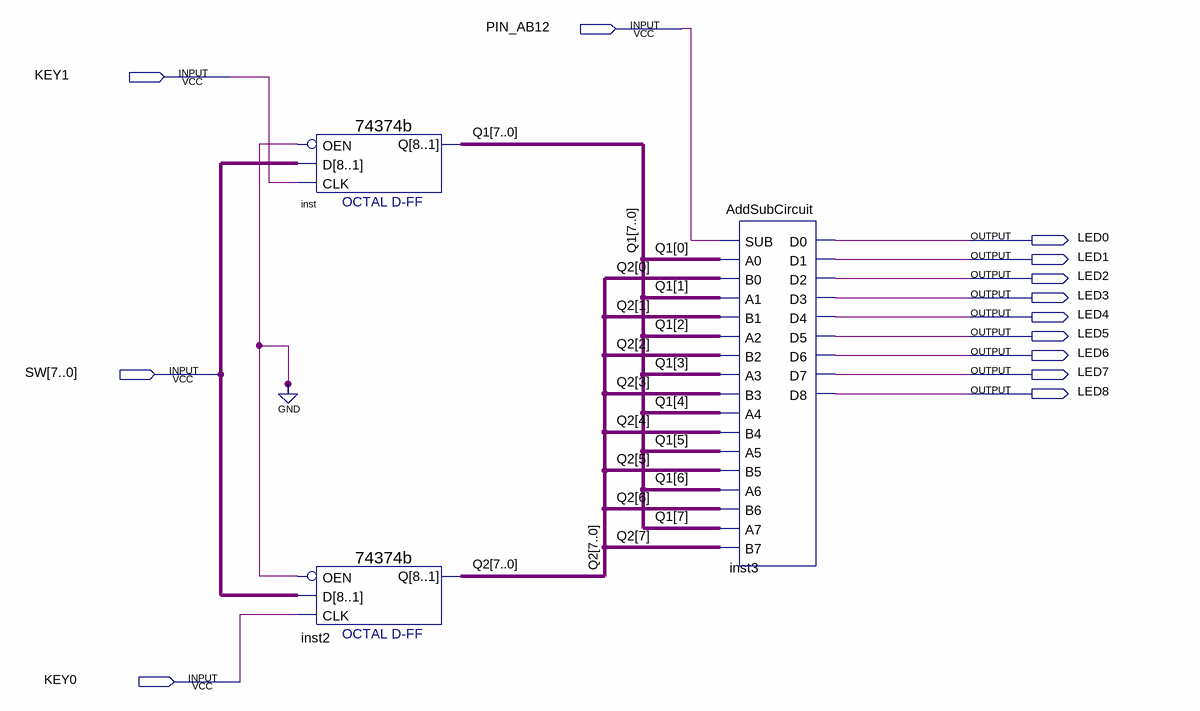
[diagram p0: schematic sheet]
// Quartus schematic Bit8Adder.bdf as structural Verilog: 3 symbols, 13 pins
module Bit8Adder (
  input  PIN_AB12,
  input  KEY1,
  input  [7:0] SW,
  input  KEY0,
  output LED0,
  output LED1,
  output LED2,
  output LED3,
  output LED4,
  output LED5,
  output LED6,
  output LED7,
  output LED8
);

  wire [7:0] Q1, Q2;

  \74374b  inst (.D(SW), .OEN(1'b0), .CLK(KEY1), .Q(Q1));
  \74374b  inst2 (.D(SW), .OEN(1'b0), .CLK(KEY0), .Q(Q2));
  AddSubCircuit inst3 (
    .SUB(PIN_AB12), .A0(Q1[0]), .B0(Q2[0]), .A1(Q1[1]), .B1(Q2[1]), .A2(Q1[2]), .B2(Q2[2]), .A3(Q1[3]),
    .B3(Q2[3]), .A4(Q1[4]), .B4(Q2[4]), .A5(Q1[5]), .B5(Q2[5]), .A6(Q1[6]), .B6(Q2[6]), .A7(Q1[7]),
    .B7(Q2[7]), .D0(LED0), .D1(LED1), .D2(LED2), .D3(LED3), .D4(LED4), .D5(LED5), .D6(LED6), .D7(LED7),
    .D8(LED8));
endmodule
